# EAGLE design v7-flex2811_8x (EAGLE 7.3.0)

## Sheet 1 of 8
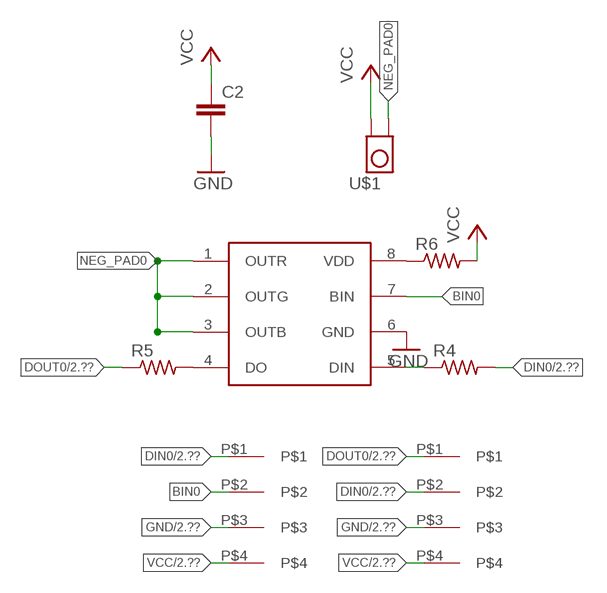
[diagram p0: schematic, sheet 1]

### Parts
C2  C-EUC0201  [C0201]
R4  R-US_R0201  [R0201]
R5  R-US_R0201  [R0201]
R6  R-US_R0201  [R0201]
U$1  TP_4MM_MED_PAD  [TP_4MM_MED_PAD]
U$2  WS2818  [SO08]
U$3  4PAD  [4PAD]
U$4  4PAD  [4PAD]

### Nets
BIN0: U$2.7(BIN) U$3.P$2
DIN0: R4.2 U$3.P$1 U$4.P$2 ; also sheet 2
DOUT0: R5.1 U$4.P$1 ; also sheet 2,3
GND: C2.2 U$2.6(GND) U$3.P$3 U$4.P$3 ; also sheet 2,3,4,5,6,7,8
N$4: R4.1 U$2.5(DIN)
N$5: R5.2 U$2.4(DO)
N$6: R6.1 U$2.8(VDD)
NEG_PAD0: U$1.P$1 U$2.1(OUTR) U$2.2(OUTG) U$2.3(OUTB)
VCC: C2.1 R6.2 U$1.P$2 U$3.P$4 U$4.P$4 ; also sheet 2,3,4,5,6,7,8

## Sheet 2 of 8
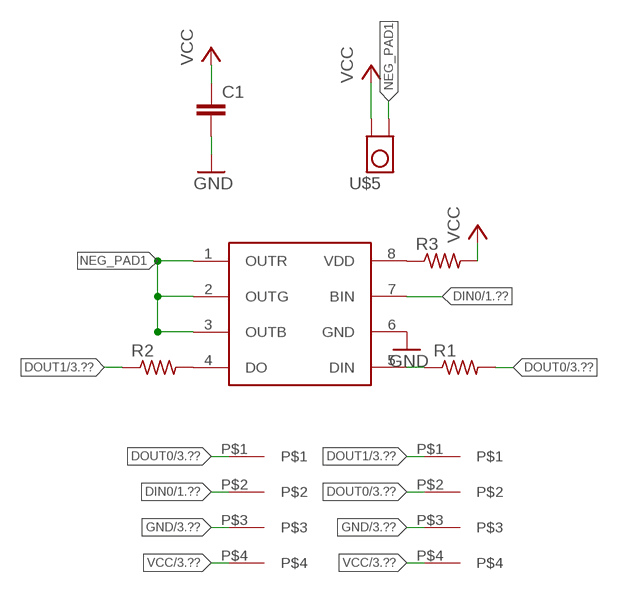
[diagram p1: schematic, sheet 2]

### Parts
C1  C-EUC0201  [C0201]
R1  R-US_R0201  [R0201]
R2  R-US_R0201  [R0201]
R3  R-US_R0201  [R0201]
U$5  TP_4MM_MED_PAD  [TP_4MM_MED_PAD]
U$6  WS2818  [SO08]
U$7  4PAD  [4PAD]
U$8  4PAD  [4PAD]

### Nets
DIN0: U$6.7(BIN) U$7.P$2 ; also sheet 1
DOUT0: R1.2 U$7.P$1 U$8.P$2 ; also sheet 1,3
DOUT1: R2.1 U$8.P$1 ; also sheet 3,4
GND: C1.2 U$6.6(GND) U$7.P$3 U$8.P$3 ; also sheet 1,3,4,5,6,7,8
N$1: R1.1 U$6.5(DIN)
N$2: R2.2 U$6.4(DO)
N$3: R3.1 U$6.8(VDD)
NEG_PAD1: U$5.P$1 U$6.1(OUTR) U$6.2(OUTG) U$6.3(OUTB)
VCC: C1.1 R3.2 U$5.P$2 U$7.P$4 U$8.P$4 ; also sheet 1,3,4,5,6,7,8

## Sheet 3 of 8
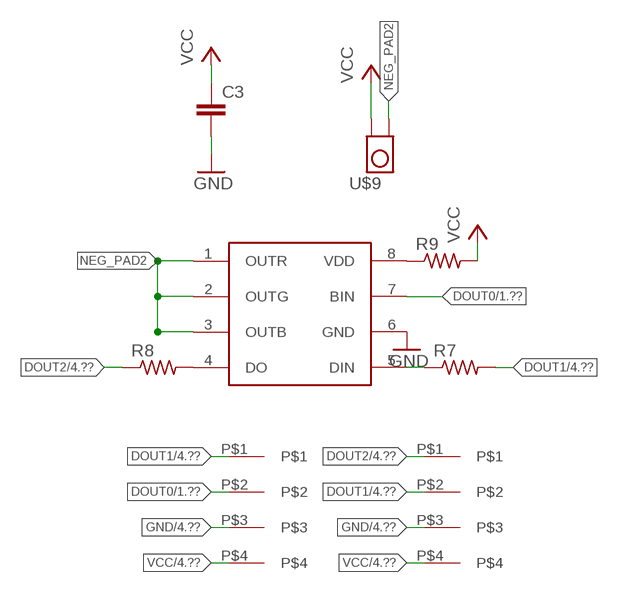
[diagram p2: schematic, sheet 3]

### Parts
C3  C-EUC0201  [C0201]
R7  R-US_R0201  [R0201]
R8  R-US_R0201  [R0201]
R9  R-US_R0201  [R0201]
U$9  TP_4MM_MED_PAD  [TP_4MM_MED_PAD]
U$10  WS2818  [SO08]
U$11  4PAD  [4PAD]
U$12  4PAD  [4PAD]

### Nets
DOUT0: U$10.7(BIN) U$11.P$2 ; also sheet 1,2
DOUT1: R7.2 U$11.P$1 U$12.P$2 ; also sheet 2,4
DOUT2: R8.1 U$12.P$1 ; also sheet 4,5
GND: C3.2 U$10.6(GND) U$11.P$3 U$12.P$3 ; also sheet 1,2,4,5,6,7,8
N$7: R7.1 U$10.5(DIN)
N$8: R8.2 U$10.4(DO)
N$9: R9.1 U$10.8(VDD)
NEG_PAD2: U$9.P$1 U$10.1(OUTR) U$10.2(OUTG) U$10.3(OUTB)
VCC: C3.1 R9.2 U$9.P$2 U$11.P$4 U$12.P$4 ; also sheet 1,2,4,5,6,7,8

## Sheet 4 of 8
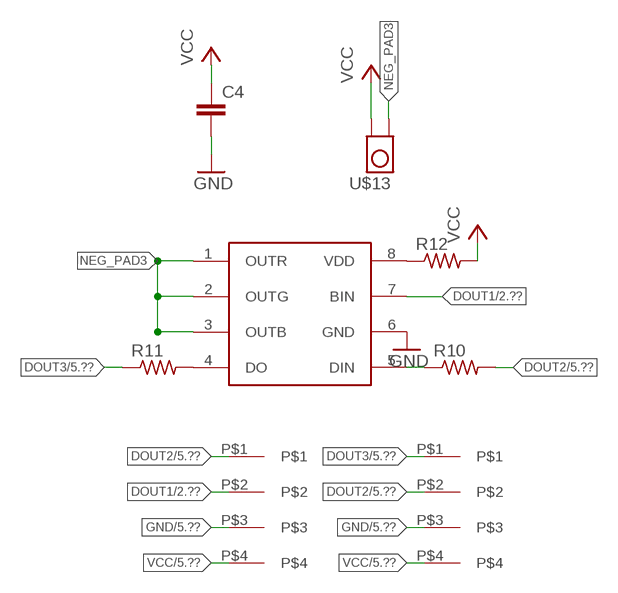
[diagram p3: schematic, sheet 4]

### Parts
C4  C-EUC0201  [C0201]
R10  R-US_R0201  [R0201]
R11  R-US_R0201  [R0201]
R12  R-US_R0201  [R0201]
U$13  TP_4MM_MED_PAD  [TP_4MM_MED_PAD]
U$14  WS2818  [SO08]
U$15  4PAD  [4PAD]
U$16  4PAD  [4PAD]

### Nets
DOUT1: U$14.7(BIN) U$15.P$2 ; also sheet 2,3
DOUT2: R10.2 U$15.P$1 U$16.P$2 ; also sheet 3,5
DOUT3: R11.1 U$16.P$1 ; also sheet 5,6
GND: C4.2 U$14.6(GND) U$15.P$3 U$16.P$3 ; also sheet 1,2,3,5,6,7,8
N$10: R10.1 U$14.5(DIN)
N$11: R11.2 U$14.4(DO)
N$12: R12.1 U$14.8(VDD)
NEG_PAD3: U$13.P$1 U$14.1(OUTR) U$14.2(OUTG) U$14.3(OUTB)
VCC: C4.1 R12.2 U$13.P$2 U$15.P$4 U$16.P$4 ; also sheet 1,2,3,5,6,7,8

## Sheet 5 of 8
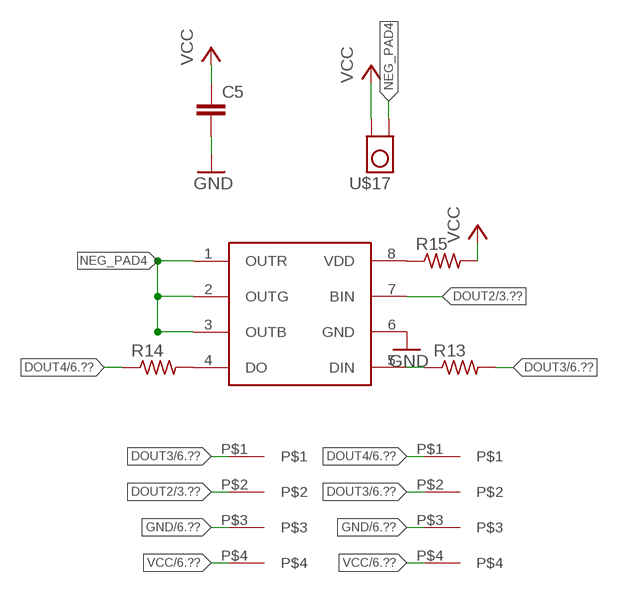
[diagram p4: schematic, sheet 5]

### Parts
C5  C-EUC0201  [C0201]
R13  R-US_R0201  [R0201]
R14  R-US_R0201  [R0201]
R15  R-US_R0201  [R0201]
U$17  TP_4MM_MED_PAD  [TP_4MM_MED_PAD]
U$18  WS2818  [SO08]
U$19  4PAD  [4PAD]
U$20  4PAD  [4PAD]

### Nets
DOUT2: U$18.7(BIN) U$19.P$2 ; also sheet 3,4
DOUT3: R13.2 U$19.P$1 U$20.P$2 ; also sheet 4,6
DOUT4: R14.1 U$20.P$1 ; also sheet 6,7
GND: C5.2 U$18.6(GND) U$19.P$3 U$20.P$3 ; also sheet 1,2,3,4,6,7,8
N$13: R13.1 U$18.5(DIN)
N$14: R14.2 U$18.4(DO)
N$15: R15.1 U$18.8(VDD)
NEG_PAD4: U$17.P$1 U$18.1(OUTR) U$18.2(OUTG) U$18.3(OUTB)
VCC: C5.1 R15.2 U$17.P$2 U$19.P$4 U$20.P$4 ; also sheet 1,2,3,4,6,7,8

## Sheet 6 of 8
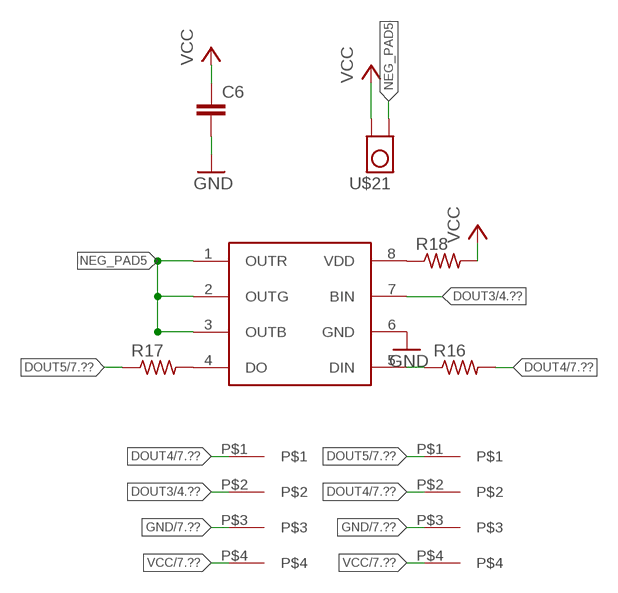
[diagram p5: schematic, sheet 6]

### Parts
C6  C-EUC0201  [C0201]
R16  R-US_R0201  [R0201]
R17  R-US_R0201  [R0201]
R18  R-US_R0201  [R0201]
U$21  TP_4MM_MED_PAD  [TP_4MM_MED_PAD]
U$22  WS2818  [SO08]
U$23  4PAD  [4PAD]
U$24  4PAD  [4PAD]

### Nets
DOUT3: U$22.7(BIN) U$23.P$2 ; also sheet 4,5
DOUT4: R16.2 U$23.P$1 U$24.P$2 ; also sheet 5,7
DOUT5: R17.1 U$24.P$1 ; also sheet 7,8
GND: C6.2 U$22.6(GND) U$23.P$3 U$24.P$3 ; also sheet 1,2,3,4,5,7,8
N$16: R16.1 U$22.5(DIN)
N$17: R17.2 U$22.4(DO)
N$18: R18.1 U$22.8(VDD)
NEG_PAD5: U$21.P$1 U$22.1(OUTR) U$22.2(OUTG) U$22.3(OUTB)
VCC: C6.1 R18.2 U$21.P$2 U$23.P$4 U$24.P$4 ; also sheet 1,2,3,4,5,7,8

## Sheet 7 of 8
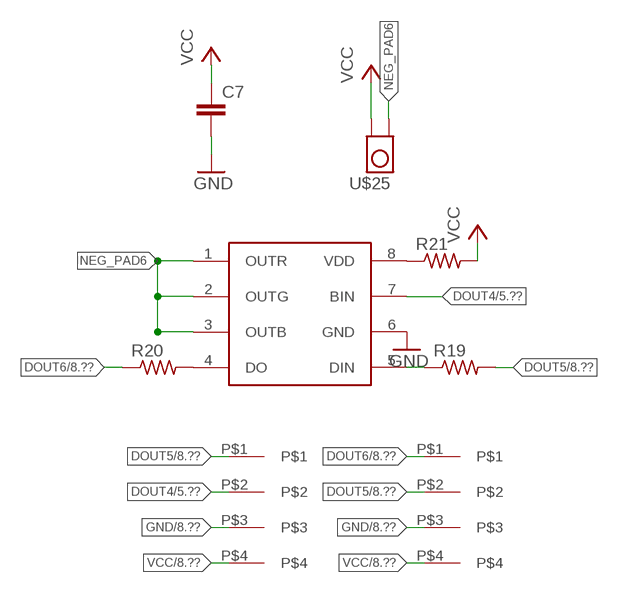
[diagram p6: schematic, sheet 7]

### Parts
C7  C-EUC0201  [C0201]
R19  R-US_R0201  [R0201]
R20  R-US_R0201  [R0201]
R21  R-US_R0201  [R0201]
U$25  TP_4MM_MED_PAD  [TP_4MM_MED_PAD]
U$26  WS2818  [SO08]
U$27  4PAD  [4PAD]
U$28  4PAD  [4PAD]

### Nets
DOUT4: U$26.7(BIN) U$27.P$2 ; also sheet 5,6
DOUT5: R19.2 U$27.P$1 U$28.P$2 ; also sheet 6,8
DOUT6: R20.1 U$28.P$1 ; also sheet 8
GND: C7.2 U$26.6(GND) U$27.P$3 U$28.P$3 ; also sheet 1,2,3,4,5,6,8
N$19: R19.1 U$26.5(DIN)
N$20: R20.2 U$26.4(DO)
N$21: R21.1 U$26.8(VDD)
NEG_PAD6: U$25.P$1 U$26.1(OUTR) U$26.2(OUTG) U$26.3(OUTB)
VCC: C7.1 R21.2 U$25.P$2 U$27.P$4 U$28.P$4 ; also sheet 1,2,3,4,5,6,8

## Sheet 8 of 8
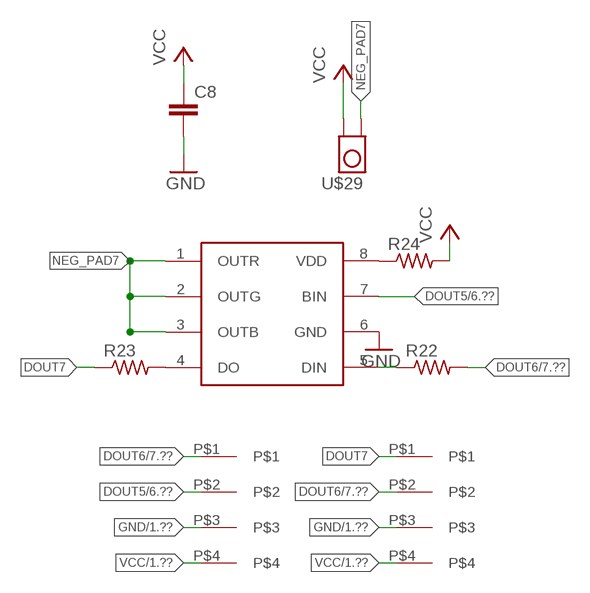
[diagram p7: schematic, sheet 8]

### Parts
C8  C-EUC0201  [C0201]
R22  R-US_R0201  [R0201]
R23  R-US_R0201  [R0201]
R24  R-US_R0201  [R0201]
U$29  TP_4MM_MED_PAD  [TP_4MM_MED_PAD]
U$30  WS2818  [SO08]
U$31  4PAD  [4PAD]
U$32  4PAD  [4PAD]

### Nets
DOUT5: U$30.7(BIN) U$31.P$2 ; also sheet 6,7
DOUT6: R22.2 U$31.P$1 U$32.P$2 ; also sheet 7
DOUT7: R23.1 U$32.P$1
GND: C8.2 U$30.6(GND) U$31.P$3 U$32.P$3 ; also sheet 1,2,3,4,5,6,7
N$22: R22.1 U$30.5(DIN)
N$23: R23.2 U$30.4(DO)
N$24: R24.1 U$30.8(VDD)
NEG_PAD7: U$29.P$1 U$30.1(OUTR) U$30.2(OUTG) U$30.3(OUTB)
VCC: C8.1 R24.2 U$29.P$2 U$31.P$4 U$32.P$4 ; also sheet 1,2,3,4,5,6,7

## Library data of the parts
C1-C8 = rcl:C-EU: CAPACITOR, European symbol
R1-R24 = rcl:R-US_: RESISTOR, American symbol
U$1 U$5 U$9 U$13 U$17 U$21 U$25 U$29 = tom-tappytap-v5-flex:TP_4MM_MED_PAD
U$2 U$6 U$10 U$14 U$18 U$22 U$26 U$30 = Sparky:WS2818
U$3 U$4 U$7 U$8 U$11 U$12 U$15 U$16 U$19 U$20 U$23 U$24 U$27 U$28 U$31 U$32 = Sparky:4PAD

## Board
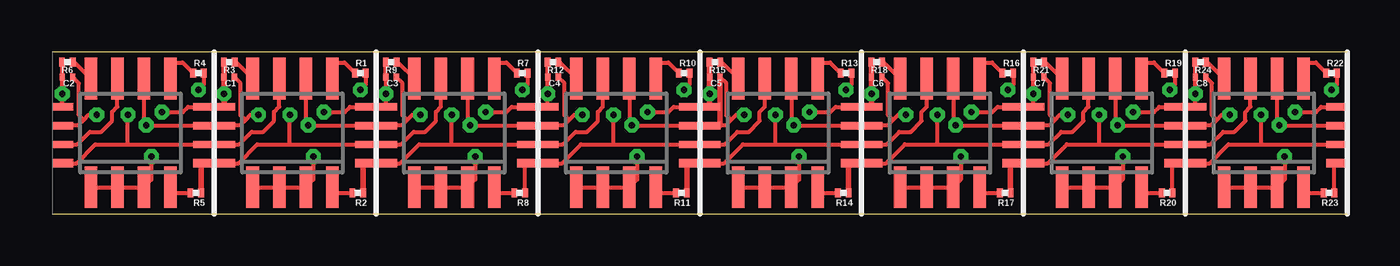
[diagram p8: board, top side]
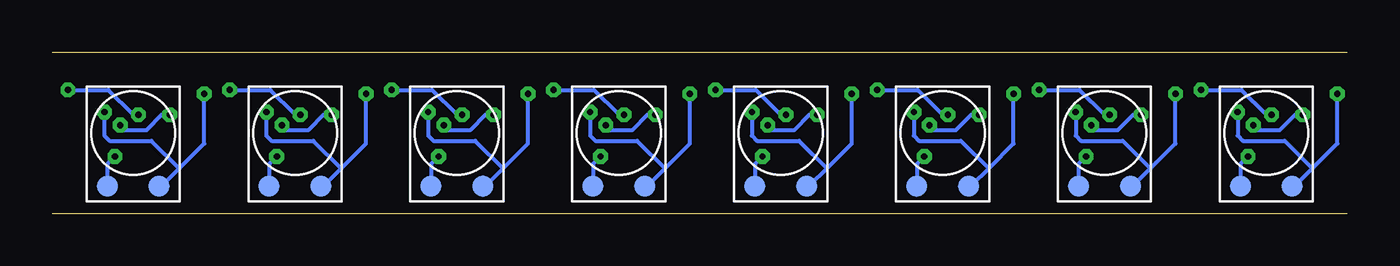
[diagram p9: board, bottom side, seen from below]

Size 62 x 7.75 mm. Coordinates in mm from the lower left corner, seen from the top.
Outline: 0,0 62,0
Outline: 62,7.75 0,7.75
Copper layers (1*16): Top 0.035mm / dielectric 1.5mm / Bottom 0.035mm
Design rules "default": minimum track width 10mil, minimum drill 24mil, track to track 8mil, track to pad 8mil, pad to pad 8mil, via to via 8mil, smd to smd 8mil, copper to edge 40mil, drill to drill 8mil, minimum pad ring 10mil, minimum via ring 8mil, stop-mask expansion 4mil, vias tented up to drill 0mil, thermal gap 10mil

### Footprints (pad centres in the part's own frame; a part is rotated, then mirrored left to right if it is on the bottom)
C0201 = smd 0.25 x 0.35: 1 -0.25,0; 2 0.25,0
R0201 = smd 0.28 x 0.43: 1 -0.255,0; 2 0.255,0
TP_4MM_MED_PAD = smd 1.016 x 1.016: P$1 -1.24,-2.55; P$2 1.24,-2.55
SO08 = smd 0.6 x 2: 1 -1.905,-2.6; 2 -0.635,-2.6; 3 0.635,-2.6; 4 1.905,-2.6; 5 1.905,2.6; 6 0.635,2.6; 7 -0.635,2.6; 8 -1.905,2.6
4PAD = smd 1 x 0.4: P$1 0,0.3 | smd 1 x 0.35: P$2 0,1.2; P$3 0,2.1; P$4 0,3

### Placement (x,y rotation side)
C1  8.47,6.55 0 top
C2  0.72,6.55 0 top
C3  16.23,6.55 0 top
C4  23.98,6.55 0 top
C5  31.73,6.55 0 top
C6  39.48,6.55 0 top
C7  47.23,6.55 0 top
C8  54.98,6.55 0 top
R1  14.75,6.75 0 top
R2  14.62,1 180 top
R3  8.47,7.28 180 top
R4  7,6.75 0 top
R5  6.88,1 180 top
R6  0.72,7.28 180 top
R7  22.5,6.75 0 top
R8  22.38,1 180 top
R9  16.23,7.28 180 top
R10  30.25,6.75 0 top
R11  30.12,1 180 top
R12  23.98,7.28 180 top
R13  38,6.75 0 top
R14  37.88,1 180 top
R15  31.73,7.28 180 top
R16  45.75,6.75 0 top
R17  45.62,1 180 top
R18  39.48,7.28 180 top
R19  53.5,6.75 0 top
R20  53.38,1 180 top
R21  47.23,7.28 180 top
R22  61.25,6.75 0 top
R23  61.12,1 180 top
R24  54.98,7.28 180 top
U$1  3.88,3.88 0 bottom
U$2  3.75,3.88 0 top
U$3  0.5,2.12 0 top
U$4  7.25,2.12 0 top
U$5  11.62,3.88 0 bottom
U$6  11.5,3.88 0 top
U$7  8.25,2.12 0 top
U$8  15,2.12 0 top
U$9  19.38,3.88 0 bottom
U$10  19.25,3.88 0 top
U$11  16,2.12 0 top
U$12  22.75,2.12 0 top
U$13  27.12,3.88 0 bottom
U$14  27,3.88 0 top
U$15  23.75,2.12 0 top
U$16  30.5,2.12 0 top
U$17  34.88,3.88 0 bottom
U$18  34.75,3.88 0 top
U$19  31.5,2.12 0 top
U$20  38.25,2.12 0 top
U$21  42.62,3.88 0 bottom
U$22  42.5,3.88 0 top
U$23  39.25,2.12 0 top
U$24  46,2.12 0 top
U$25  50.38,3.88 0 bottom
U$26  50.25,3.88 0 top
U$27  47,2.12 0 top
U$28  53.75,2.12 0 top
U$29  58.12,3.88 0 bottom
U$30  58,3.88 0 top
U$31  54.75,2.12 0 top
U$32  61.5,2.12 0 top

### Tracks (layer width: path | path; a pad name or v marks a point on that pad's centre or on a via)
BIN0
  Top 0.2: U$3.P$2 1.2,3.33 1.8,3.93 2.35,3.93 2.87,4.45 2.87,4.89 3.12,5.13 U$2.7
DIN0  (via drill 0.3)
  Top 0.2: 3.62,3.33 v3.62,4.75 | R4.2 7.25,6.2 v7,5.94 | U$3.P$1 1.17,2.42 2.06,3.33 3.62,3.33 | 3.62,3.33 U$4.P$2 | U$7.P$2 8.95,3.33 9.55,3.93 10.1,3.93 10.62,4.45 10.62,4.89 10.87,5.13 U$6.7
  Top 0.254: U$7.P$2 U$4.P$2
  Bottom 0.2: v3.62,4.75 3.88,4.75 5.07,5.94 v7,5.94
DOUT0  (via drill 0.3)
  Top 0.2: R5.1 7.13,2.31 U$4.P$1 | 11.38,3.33 v11.38,4.75 | R1.2 15.01,6.2 v14.75,5.94 | U$7.P$1 8.91,2.42 9.81,3.33 11.38,3.33 | 11.38,3.33 U$8.P$2 | U$11.P$2 16.7,3.33 17.3,3.93 17.85,3.93 18.37,4.45 18.37,4.89 18.61,5.13 U$10.7 18.62,6.46
  Top 0.254: U$7.P$1 7.13,2.42 R5.1 | U$11.P$2 U$8.P$2
  Bottom 0.2: v11.38,4.75 11.62,4.75 12.81,5.94 v14.75,5.94
DOUT1  (via drill 0.3)
  Top 0.2: R2.1 14.88,2.31 U$8.P$1 | 19.12,3.33 v19.12,4.75 | R7.2 22.75,6.2 v22.5,5.94 | U$11.P$1 16.66,2.42 17.57,3.33 19.12,3.33 | 19.12,3.33 U$12.P$2 | U$15.P$2 24.45,3.33 25.05,3.93 25.6,3.93 26.12,4.45 26.12,4.89 26.36,5.13 U$14.7 26.38,6.46
  Top 0.254: U$11.P$1 14.88,2.42 R2.1 | U$15.P$2 U$12.P$2
  Bottom 0.2: v19.12,4.75 19.38,4.75 20.57,5.94 v22.5,5.94
DOUT2  (via drill 0.3)
  Top 0.2: R8.1 22.63,2.31 U$12.P$1 | 26.88,3.33 v26.88,4.75 | R10.2 30.5,6.2 v30.25,5.94 | U$15.P$1 24.41,2.42 25.32,3.33 26.88,3.33 | 26.88,3.33 U$16.P$2 | U$19.P$2 32.2,3.33 32.8,3.93 33.35,3.93 33.87,4.45 33.87,4.89 34.12,5.13 U$18.7
  Top 0.254: U$12.P$1 U$15.P$1 | U$16.P$2 U$19.P$2
  Bottom 0.2: v26.88,4.75 27.12,4.75 28.32,5.94 v30.25,5.94
DOUT3  (via drill 0.3)
  Top 0.2: R11.1 30.38,2.31 U$16.P$1 | 34.62,3.33 v34.62,4.75 | R13.2 38.26,6.2 v38,5.94 | U$19.P$1 32.16,2.42 33.06,3.33 34.62,3.33 | 34.62,3.33 U$20.P$2 | U$23.P$2 39.95,3.33 40.55,3.93 41.1,3.93 41.62,4.45 41.62,4.89 41.87,5.13 U$22.7
  Top 0.254: U$23.P$2 U$20.P$2 | U$19.P$1 30.38,2.42 R11.1
  Bottom 0.2: v34.62,4.75 34.88,4.75 36.06,5.94 v38,5.94
DOUT4  (via drill 0.3)
  Top 0.2: R14.1 38.13,2.31 U$20.P$1 | 42.38,3.33 v42.38,4.75 | R16.2 46.01,6.2 v45.75,5.94 | U$23.P$1 39.91,2.42 40.81,3.33 42.38,3.33 | 42.38,3.33 U$24.P$2 | U$27.P$2 47.7,3.33 48.3,3.93 48.85,3.93 49.37,4.45 49.37,4.89 49.62,5.13 U$26.7
  Top 0.254: U$23.P$1 38.13,2.42 R14.1 | U$27.P$2 U$24.P$2
  Bottom 0.2: v42.38,4.75 42.62,4.75 43.81,5.94 v45.75,5.94
DOUT5  (via drill 0.3)
  Top 0.2: R17.1 45.88,2.31 U$24.P$1 | 50.12,3.33 v50.12,4.75 | R19.2 53.76,6.2 v53.5,5.94 | U$27.P$1 47.66,2.42 48.56,3.33 50.12,3.33 | 50.12,3.33 U$28.P$2 | U$31.P$2 55.45,3.33 56.05,3.93 56.6,3.93 57.12,4.45 57.12,4.89 57.37,5.13 U$30.7
  Top 0.254: U$27.P$1 45.88,2.42 R17.1 | U$31.P$2 U$28.P$2
  Bottom 0.2: v50.12,4.75 50.38,4.75 51.56,5.94 v53.5,5.94
DOUT6  (via drill 0.3)
  Top 0.2: R20.1 53.63,2.31 U$28.P$1 | 57.88,3.33 v57.88,4.75 | R22.2 61.51,6.2 v61.25,5.94 | U$31.P$1 55.41,2.42 56.31,3.33 57.88,3.33 | 57.88,3.33 U$32.P$2
  Top 0.254: U$28.P$1 U$31.P$1
  Bottom 0.2: v57.88,4.75 58.12,4.75 59.31,5.94 v61.25,5.94
DOUT7
  Top 0.2: R23.1 61.38,2.31 U$32.P$1
GND  (via drill 0.3)
  Top 0.2: U$2.6 4.38,4.37 v4.5,4.25 4.53,4.22 U$4.P$3 7.22,4.25 | U$3.P$3 0.85,4.22 0.88,4.25 1.25,4.25 1.5,4.5 | 1.5,4.5 1.75,4.75 v2.12,4.75 | 1.5,4.5 1.27,4.73 1.27,6.25 C2.2 | U$6.6 12.13,4.37 v12.25,4.25 12.28,4.22 U$8.P$3 14.97,4.25 | U$7.P$3 8.6,4.22 8.62,4.25 9,4.25 9.25,4.5 | 9.25,4.5 9.5,4.75 v9.88,4.75 | 9.25,4.5 9.02,4.73 9.02,6.25 C1.2 | U$10.6 19.89,4.37 v20,4.25 20.02,4.22 U$12.P$3 22.73,4.25 | U$11.P$3 16.35,4.22 16.38,4.25 16.75,4.25 17,4.5 | 17,4.5 17.25,4.75 v17.62,4.75 | 17,4.5 16.77,4.73 16.77,6.25 C3.2 | U$14.6 27.64,4.37 v27.75,4.25 27.77,4.22 U$16.P$3 30.48,4.25 | U$15.P$3 24.1,4.22 24.12,4.25 24.5,4.25 24.75,4.5 | 24.75,4.5 25,4.75 v25.38,4.75 | 24.75,4.5 24.52,4.73 24.52,6.25 C4.2 | U$18.6 35.38,4.37 v35.5,4.25 35.52,4.22 U$20.P$3 38.23,4.25 | U$19.P$3 31.85,4.22 31.88,4.25 32.25,4.25 32.5,4.5 | 32.5,4.5 32.75,4.75 v33.12,4.75 | 32.5,4.5 32.27,4.73 32.27,6.25 C5.2 | U$22.6 43.13,4.37 v43.25,4.25 43.27,4.22 U$24.P$3 45.98,4.25 | U$23.P$3 39.6,4.22 39.62,4.25 40,4.25 40.25,4.5 | 40.25,4.5 40.5,4.75 v40.88,4.75 | 40.25,4.5 40.02,4.73 40.02,6.25 C6.2 | U$26.6 50.88,4.37 v51,4.25 51.02,4.22 U$28.P$3 53.73,4.25 | U$27.P$3 47.35,4.22 47.38,4.25 47.75,4.25 48,4.5 | 48,4.5 48.25,4.75 v48.62,4.75 | 48,4.5 47.77,4.73 47.77,6.25 C7.2 | U$30.6 58.63,4.37 v58.75,4.25 58.77,4.22 U$32.P$3 61.48,4.25 | U$31.P$3 55.1,4.22 55.12,4.25 55.5,4.25 55.75,4.5 | 55.75,4.5 56,4.75 v56.38,4.75 | 55.75,4.5 55.52,4.73 55.52,6.25 C8.2
  Top 0.254: U$7.P$3 U$4.P$3 | U$11.P$3 U$8.P$3 | U$15.P$3 U$12.P$3 | U$23.P$3 U$20.P$3 | U$27.P$3 U$24.P$3 | U$31.P$3 U$28.P$3 | U$16.P$3 31.98,4.22 C5.2
  Bottom 0.2: v4.5,4.25 4.5,4 3.25,4 2.5,4.75 v2.12,4.75 | v12.25,4.25 12.25,4 11,4 10.25,4.75 v9.88,4.75 | v20,4.25 20,4 18.75,4 18,4.75 v17.62,4.75 | v27.75,4.25 27.75,4 26.5,4 25.75,4.75 v25.38,4.75 | v35.5,4.25 35.5,4 34.25,4 33.5,4.75 v33.12,4.75 | v43.25,4.25 43.25,4 42,4 41.25,4.75 v40.88,4.75 | v51,4.25 51,4 49.75,4 49,4.75 v48.62,4.75 | v58.75,4.25 58.75,4 57.5,4 56.75,4.75 v56.38,4.75
N$1
  Top 0.2: 13.4,6.78 U$6.5 13.38,6.5 13.38,7 13.62,7.25 13.99,7.25 R1.1
N$2
  Top 0.2: U$6.4 13.68,1 R2.2
N$3
  Top 0.2: 9.6,6.78 U$6.8 8.79,7.28 R3.1
N$4
  Top 0.2: 5.66,6.78 U$2.5 5.62,6.5 5.62,7 5.88,7.25 6.25,7.25 R4.1
N$5
  Top 0.2: U$2.4 5.93,1 R5.2
N$6
  Top 0.2: 1.84,6.78 U$2.8 1.04,7.28 R6.1
N$7
  Top 0.2: 21.16,6.78 U$10.5 21.12,6.5 21.12,7 21.38,7.25 21.75,7.25 R7.1
N$8
  Top 0.2: U$10.4 21.43,1 R8.2
N$9
  Top 0.2: 17.34,6.78 U$10.8 16.55,7.28 R9.1
N$10
  Top 0.2: 28.91,6.78 U$14.5 28.88,6.5 28.88,7 29.12,7.25 29.5,7.25 R10.1
N$11
  Top 0.2: U$14.4 29.18,1 R11.2
N$12
  Top 0.2: 25.09,6.78 U$14.8 24.3,7.28 R12.1
N$13
  Top 0.2: 36.66,6.78 U$18.5 36.62,6.5 36.62,7 36.88,7.25 37.24,7.25 R13.1
N$14
  Top 0.2: U$18.4 36.93,1 R14.2
N$15
  Top 0.2: 32.84,6.78 U$18.8 32.05,7.28 R15.1
N$16
  Top 0.2: 44.41,6.78 U$22.5 44.38,6.5 44.38,7 44.62,7.25 44.99,7.25 R16.1
N$17
  Top 0.2: U$22.4 44.68,1 R17.2
N$18
  Top 0.2: 40.59,6.78 U$22.8 39.8,7.28 R18.1
N$19
  Top 0.2: 52.16,6.78 U$26.5 52.12,6.5 52.12,7 52.38,7.25 52.74,7.25 R19.1
N$20
  Top 0.2: U$26.4 52.43,1 R20.2
N$21
  Top 0.2: 48.34,6.78 U$26.8 47.55,7.28 R21.1
N$22
  Top 0.2: 59.91,6.78 U$30.5 59.88,6.5 59.88,7 60.12,7.25 60.49,7.25 R22.1
N$23
  Top 0.2: U$30.4 60.18,1 R23.2
N$24
  Top 0.2: 56.09,6.78 U$30.8 55.3,7.28 R24.1
NEG_PAD0  (via drill 0.3)
  Top 0.2: U$2.1 U$2.2 U$2.3 4.75,1.64 v4.75,2.75
  Bottom 0.2: v4.75,2.75 5.12,2.38 U$1.P$1
NEG_PAD1  (via drill 0.3)
  Top 0.2: U$6.1 U$6.2 U$6.3 12.5,1.64 v12.5,2.75
  Bottom 0.2: v12.5,2.75 12.87,2.38 U$5.P$1
NEG_PAD2  (via drill 0.3)
  Top 0.2: U$10.1 U$10.2 U$10.3 20.25,1.64 v20.25,2.75
  Bottom 0.2: v20.25,2.75 20.61,2.38 U$9.P$1
NEG_PAD3  (via drill 0.3)
  Top 0.2: U$14.1 U$14.2 U$14.3 28,1.64 v28,2.75
  Bottom 0.2: v28,2.75 28.36,2.38 U$13.P$1
NEG_PAD4  (via drill 0.3)
  Top 0.2: U$18.1 U$18.2 U$18.3 35.75,1.64 v35.75,2.75
  Bottom 0.2: v35.75,2.75 36.12,2.38 U$17.P$1
NEG_PAD5  (via drill 0.3)
  Top 0.2: U$22.1 U$22.2 U$22.3 43.5,1.64 v43.5,2.75
  Bottom 0.2: v43.5,2.75 43.87,2.38 U$21.P$1
NEG_PAD6  (via drill 0.3)
  Top 0.2: U$26.1 U$26.2 U$26.3 51.25,1.64 v51.25,2.75
  Bottom 0.2: v51.25,2.75 51.62,2.38 U$25.P$1
NEG_PAD7  (via drill 0.3)
  Top 0.2: U$30.1 U$30.2 U$30.3 59,1.64 v59,2.75
  Bottom 0.2: v59,2.75 59.37,2.38 U$29.P$1
VCC  (via drill 0.3)
  Top 0.2: v5.25,4.88 6.25,4.88 6.5,5.12 U$4.P$4 | U$3.P$4 0.47,5.15 v0.47,5.75 C2.1 0.47,6.66 R6.2 | v13,4.88 14,4.88 14.25,5.12 U$8.P$4 | U$7.P$4 8.22,5.15 v8.22,5.75 C1.1 8.22,6.66 R3.2 | v20.75,4.88 21.75,4.88 22,5.12 U$12.P$4 | U$11.P$4 15.97,5.15 v15.97,5.75 C3.1 15.97,6.66 R9.2 | v28.5,4.88 29.5,4.88 29.75,5.12 U$16.P$4 | U$15.P$4 23.73,5.15 v23.73,5.75 C4.1 23.72,6.66 R12.2 | v36.25,4.88 37.25,4.88 37.5,5.12 U$20.P$4 | U$19.P$4 31.48,5.15 v31.48,5.75 C5.1 31.47,6.66 R15.2 | v44,4.88 45,4.88 45.25,5.12 U$24.P$4 | U$23.P$4 39.23,5.15 v39.23,5.75 C6.1 39.22,6.66 R18.2 | v51.75,4.88 52.75,4.88 53,5.12 U$28.P$4 | U$27.P$4 46.98,5.15 v46.98,5.75 C7.1 46.97,6.66 R21.2 | v59.5,4.88 60.5,4.88 60.75,5.12 U$32.P$4 | U$31.P$4 54.73,5.15 v54.73,5.75 C8.1 54.72,6.66 R24.2
  Top 0.254: U$4.P$4 8.22,5.12 R3.2 | 15.97,5.15 15,5.15 U$8.P$4 | 23.73,5.15 22.77,5.15 U$12.P$4 | U$20.P$4 39.22,5.12 R18.2 | 46.98,5.15 46,5.15 U$24.P$4 | 54.73,5.15 53.77,5.15 U$28.P$4 | U$16.P$4 31.47,5.12 R15.2
  Bottom 0.2: v5.25,4.88 5.25,3.75 5,3.5 3,3.5 1.67,2.17 | v0.47,5.75 0.47,3.36 1.67,2.17 | 1.67,2.17 2.51,1.32 U$1.P$2 | v13,4.88 13,3.75 12.75,3.5 10.75,3.5 9.42,2.17 | v8.22,5.75 8.22,3.36 9.42,2.17 | 9.42,2.17 10.26,1.32 U$5.P$2 | v20.75,4.88 20.75,3.75 20.5,3.5 18.5,3.5 17.17,2.17 | v15.97,5.75 15.97,3.36 17.17,2.17 | 17.17,2.17 18.01,1.32 U$9.P$2 | v28.5,4.88 28.5,3.75 28.25,3.5 26.25,3.5 24.92,2.17 | v23.73,5.75 23.73,3.36 24.92,2.17 | 24.92,2.17 25.76,1.32 U$13.P$2 | v36.25,4.88 36.25,3.75 36,3.5 34,3.5 32.67,2.17 | v31.48,5.75 31.48,3.36 32.67,2.17 | 32.67,2.17 33.51,1.32 U$17.P$2 | v44,4.88 44,3.75 43.75,3.5 41.75,3.5 40.42,2.17 | v39.23,5.75 39.23,3.36 40.42,2.17 | 40.42,2.17 41.26,1.32 U$21.P$2 | v51.75,4.88 51.75,3.75 51.5,3.5 49.5,3.5 48.17,2.17 | v46.98,5.75 46.98,3.36 48.17,2.17 | 48.17,2.17 49.01,1.32 U$25.P$2 | v59.5,4.88 59.5,3.75 59.25,3.5 57.25,3.5 55.92,2.17 | v54.73,5.75 54.73,3.36 55.92,2.17 | 55.92,2.17 56.76,1.32 U$29.P$2